# Altium schematic sheet Connector.SchDoc
size A4
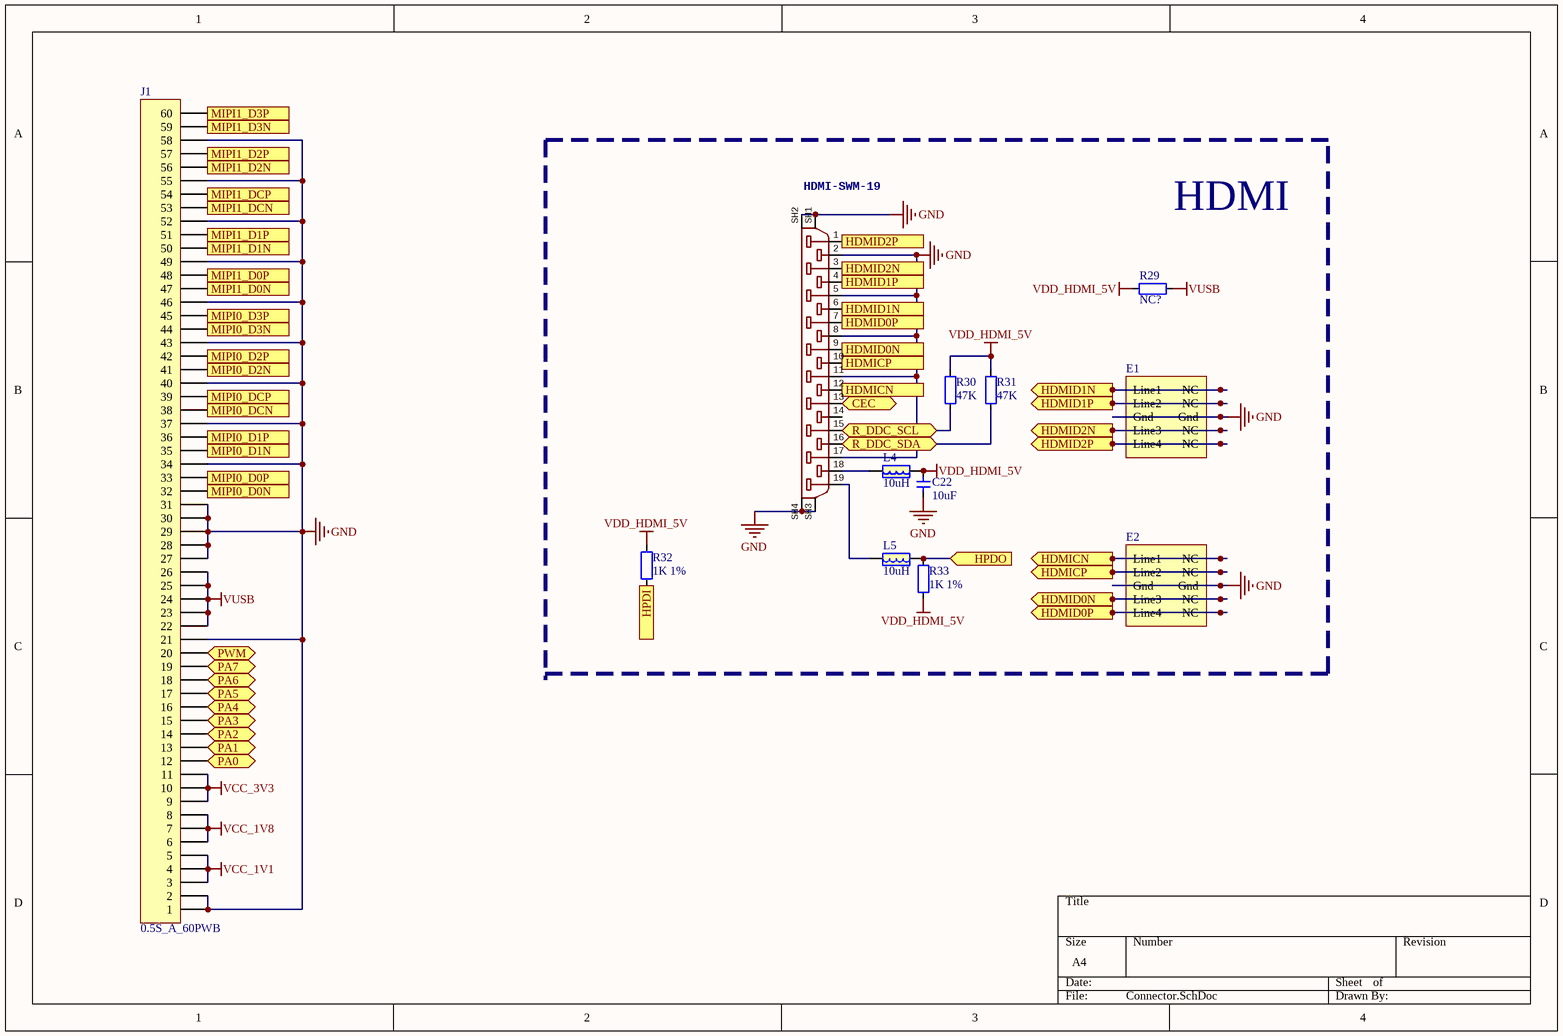
[diagram p0: Connector.SchDoc]

## Parts
C22  10uF  [CAP_0402]
E1  E?  [DFN-2510]  (value not drawn)
E2  E?  [DFN-2510]  (value not drawn)
HDMI?  HDMI-SWM-19  [HDMI-SWM-19]
J1  0.5S_A_60PWB  [FFC_0.5_60]
L4  10uH  [0805-L]
L5  10uH  [0805-L]
R29  NC?  [RES_0402]
R30  47K  [RES_0402]
R31  47K  [RES_0402]
R32  1K 1%  [RES_0402]
R33  1K 1%  [RES_0402]

## Ports
CEC (bidir), HDMICN (out), HDMICP (out), HDMID0N (out), HDMID0P (out), HDMID1N (out), HDMID1P (out), HDMID2N (out), HDMID2P (out), HPDI (out), HPDO (in), MIPI0_D0N (in), MIPI0_D0P (in), MIPI0_D1N (in), MIPI0_D1P (in), MIPI0_D2N (in), MIPI0_D2P (in), MIPI0_D3N (in), MIPI0_D3P (in), MIPI0_DCN (in), MIPI0_DCP (in), MIPI1_D0N (in), MIPI1_D0P (in), MIPI1_D1N (in), MIPI1_D1P (in), MIPI1_D2N (in), MIPI1_D2P (in), MIPI1_D3N (in), MIPI1_D3P (in), MIPI1_DCN (in), MIPI1_DCP (in), PA0 (bidir), PA1 (bidir), PA2 (bidir), PA3 (bidir), PA4 (bidir), PA5 (bidir), PA6 (bidir), PA7 (bidir), PWM (bidir), R_DDC_SCL (bidir), R_DDC_SDA (bidir)

## Nets
GND: C22.1 E1.3(Gnd) E1.8(Gnd) E2.3(Gnd) E2.8(Gnd) HDMI?.2 HDMI?.5 HDMI?.8 HDMI?.11 HDMI?.17 HDMI?.SH1 HDMI?.SH2 HDMI?.SH3 HDMI?.SH4 J1.1 J1.2 J1.21 J1.27 J1.28 J1.29 J1.30 J1.31 J1.34 J1.37 J1.40 J1.43 J1.46 J1.49 J1.52 J1.55 J1.58
VCC_1V1: J1.3 J1.4 J1.5
VCC_1V8: J1.6 J1.7 J1.8
VCC_3V3: J1.9 J1.10 J1.11
VDD_HDMI_5V: C22.2 L4.1 R29.2 R30.2 R31.2 R32.2 R33.1
VUSB: J1.22 J1.23 J1.24 J1.25 J1.26 R29.1
CEC: HDMI?.13 ; port CEC
HDMICN: E2.1(Line1) E2.10(NC) HDMI?.12 ; port HDMICN
HDMICP: E2.2(Line2) E2.9(NC) HDMI?.10 ; port HDMICP
HDMID0N: E2.4(Line3) E2.7(NC) HDMI?.9 ; port HDMID0N
HDMID0P: E2.5(Line4) E2.6(NC) HDMI?.7 ; port HDMID0P
HDMID1N: E1.1(Line1) E1.10(NC) HDMI?.6 ; port HDMID1N
HDMID1P: E1.2(Line2) E1.9(NC) HDMI?.4 ; port HDMID1P
HDMID2N: E1.4(Line3) E1.7(NC) HDMI?.3 ; port HDMID2N
HDMID2P: E1.5(Line4) E1.6(NC) HDMI?.1 ; port HDMID2P
HPDI: R32.1 ; port HPDI
HPDO: L5.1 R33.2 ; port HPDO
MIPI0_D0N: J1.32 ; port MIPI0_D0N
MIPI0_D0P: J1.33 ; port MIPI0_D0P
MIPI0_D1N: J1.35 ; port MIPI0_D1N
MIPI0_D1P: J1.36 ; port MIPI0_D1P
MIPI0_D2N: J1.41 ; port MIPI0_D2N
MIPI0_D2P: J1.42 ; port MIPI0_D2P
MIPI0_D3N: J1.44 ; port MIPI0_D3N
MIPI0_D3P: J1.45 ; port MIPI0_D3P
MIPI0_DCN: J1.38 ; port MIPI0_DCN
MIPI0_DCP: J1.39 ; port MIPI0_DCP
MIPI1_D0N: J1.47 ; port MIPI1_D0N
MIPI1_D0P: J1.48 ; port MIPI1_D0P
MIPI1_D1N: J1.50 ; port MIPI1_D1N
MIPI1_D1P: J1.51 ; port MIPI1_D1P
MIPI1_D2N: J1.56 ; port MIPI1_D2N
MIPI1_D2P: J1.57 ; port MIPI1_D2P
MIPI1_D3N: J1.59 ; port MIPI1_D3N
MIPI1_D3P: J1.60 ; port MIPI1_D3P
MIPI1_DCN: J1.53 ; port MIPI1_DCN
MIPI1_DCP: J1.54 ; port MIPI1_DCP
PA0: J1.12 ; port PA0
PA1: J1.13 ; port PA1
PA2: J1.14 ; port PA2
PA3: J1.15 ; port PA3
PA4: J1.16 ; port PA4
PA5: J1.17 ; port PA5
PA6: J1.18 ; port PA6
PA7: J1.19 ; port PA7
PWM: J1.20 ; port PWM
R_DDC_SCL: HDMI?.15 R30.1 ; port R_DDC_SCL
R_DDC_SDA: HDMI?.16 R31.1 ; port R_DDC_SDA
NetHDMI?_18: HDMI?.18 L4.2
NetHDMI?_19: HDMI?.19 L5.2

Not connected (* = marked no-connect by the designer): HDMI? 14

## Notes on the sheet
- HDMI

## Library data of the parts
C22 = 电容-0402: Capacitor; Value: 0.1u
E1 E2 = AZ1045-04F
HDMI? = HDMI-MC34931HDMI-SWM-19
J1 = FPC60-0.5mm: Header, 60-Pin; LatestRevisionDate: 17-Jul-2002; LatestRevisionNote: Re-released for DXP Platform.; Publisher: Altium Limited
L4 L5 = 电感-0805: 磁珠
R29-R33 = 电阻-0402: Resistor; Value: 22R